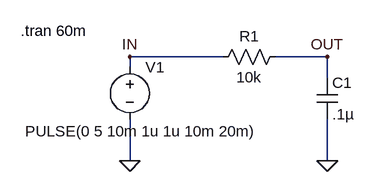
[diagram p0: schematic Draft1.asc]
Draft1.asc, the LTspice schematic file:
Version 4.1
SHEET 1 880 680
WIRE 192 112 48 112
WIRE 352 112 272 112
WIRE 48 128 48 112
WIRE 352 144 352 112
WIRE 48 272 48 208
WIRE 352 272 352 208
FLAG 48 272 0
FLAG 352 272 0
FLAG 48 112 IN
FLAG 352 112 OUT
SYMBOL voltage 48 112 R0
WINDOW 3 -161 114 Left 2
WINDOW 123 0 0 Left 0
WINDOW 39 0 0 Left 0
SYMATTR InstName V1
SYMATTR Value PULSE(0 5 10m 1u 1u 10m 20m)
SYMBOL res 288 96 R90
WINDOW 0 0 56 VBottom 2
WINDOW 3 32 56 VTop 2
SYMATTR InstName R1
SYMATTR Value 10k
SYMBOL cap 336 144 R0
SYMATTR InstName C1
SYMATTR Value .1µ
TEXT -120 72 Left 2 !.tran 60m

The netlist it stands for:
* Draft1.asc
V1 IN 0 PULSE(0 5 10m 1u 1u 10m 20m)
R1 OUT IN 10k
C1 OUT 0 .1µ
.tran 60m
.backanno
.end